# EAGLE schematic carcomputer_split3_bottom (EAGLE 9.3.2)
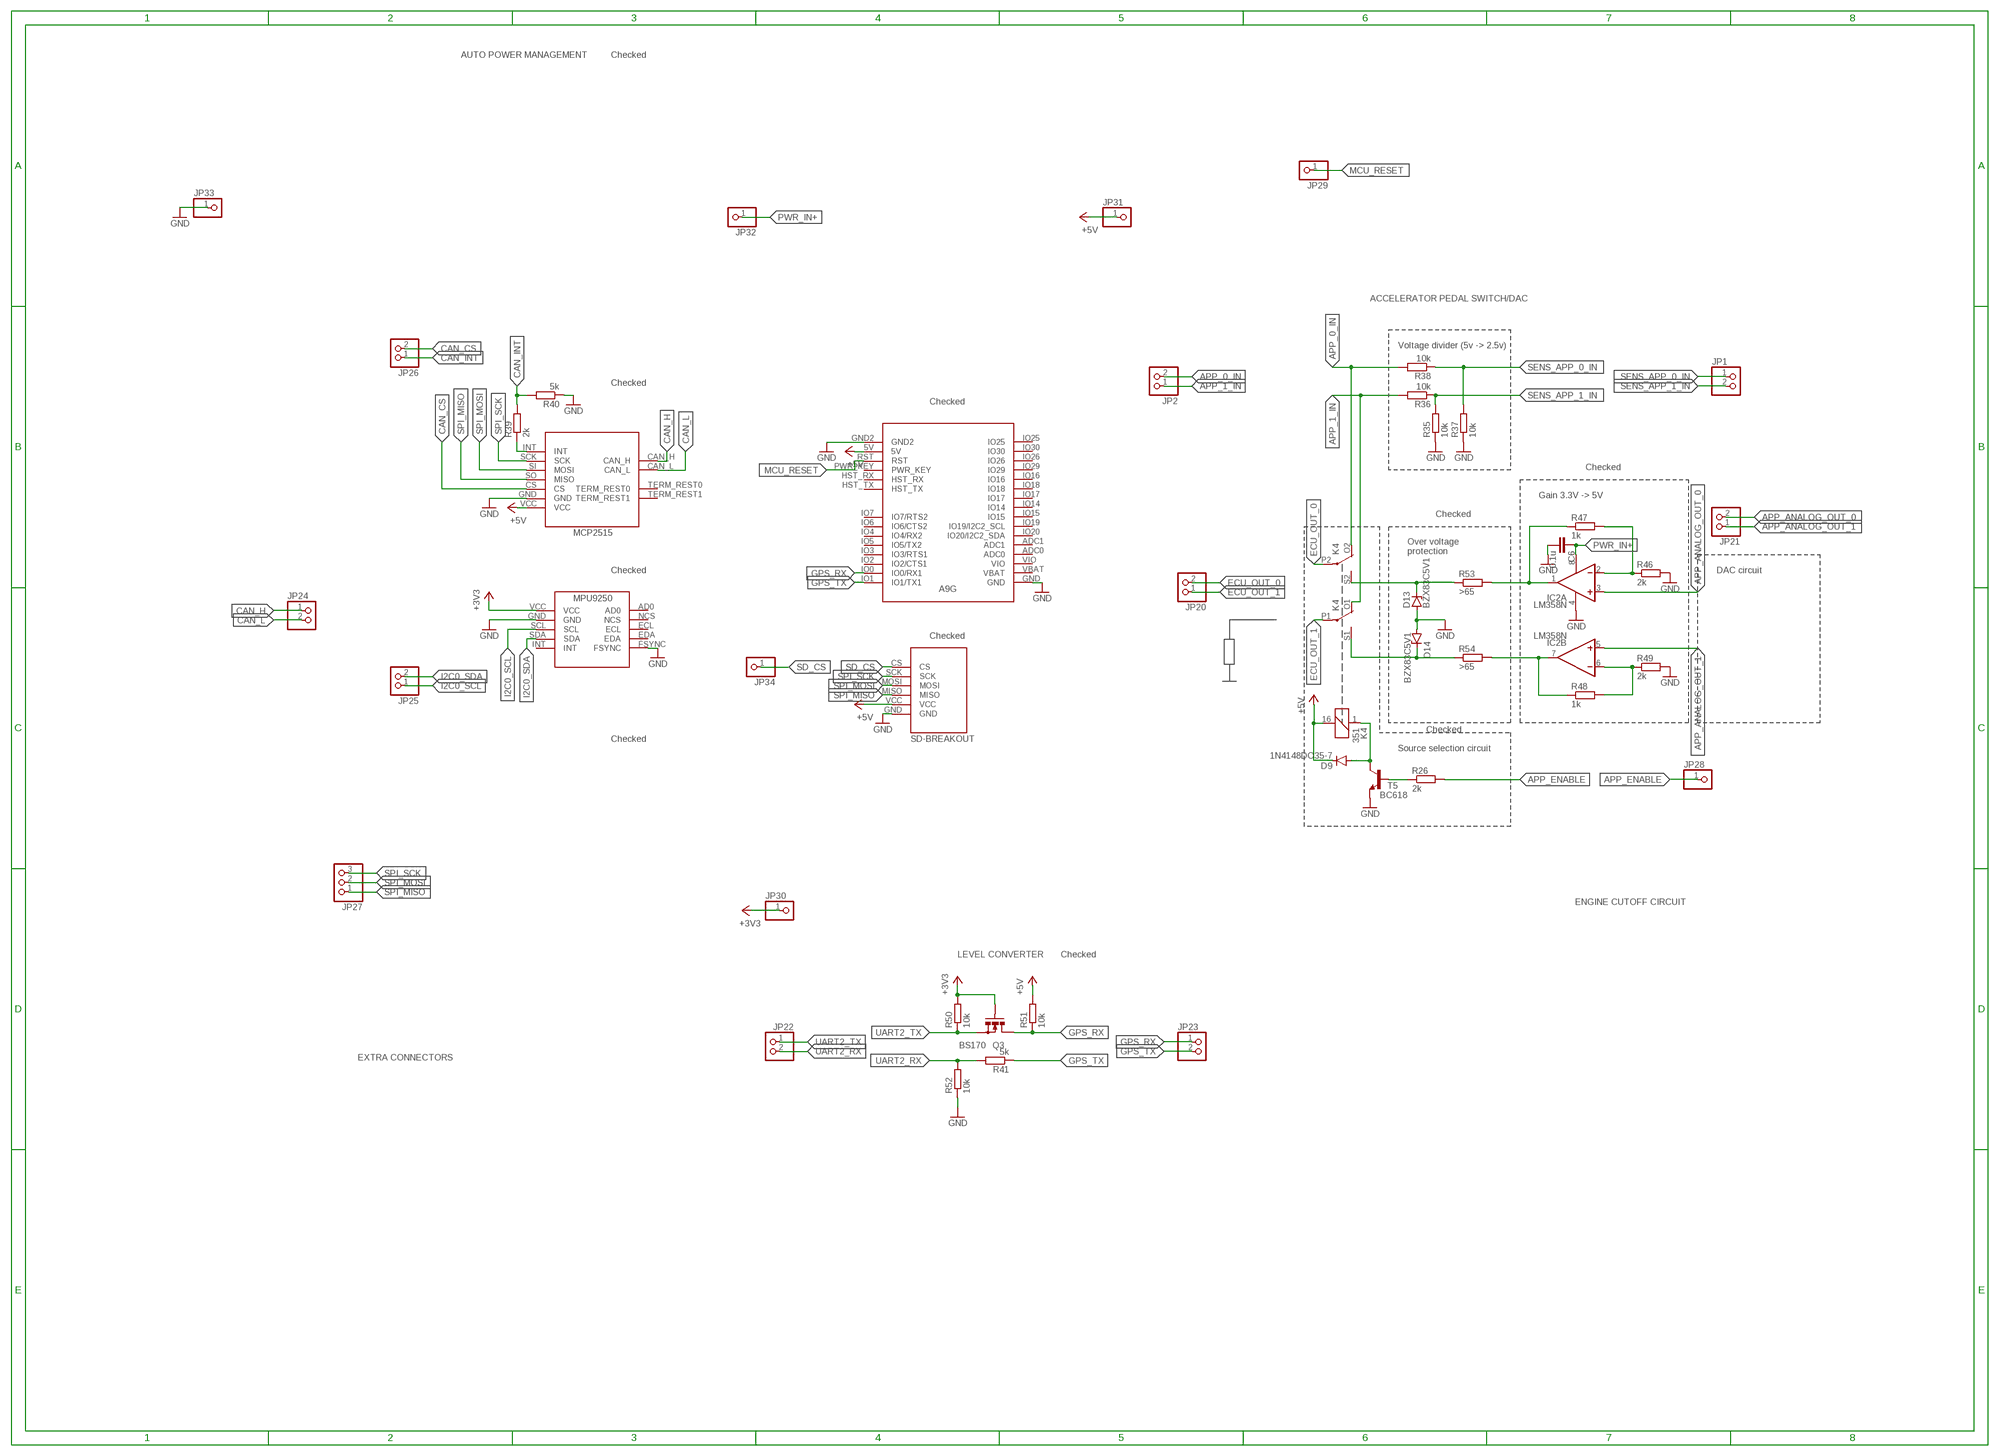
[diagram p0: schematic, sheet 1]

## Parts
C6  0.1u  C-EU025-050X050  [C025-050X050]
D9  1N4148DO35-7  [DO35-7]
D13  BZX83C5V1  BZX85  [DO41Z10]
D14  BZX83C5V1  BZX85  [DO41Z10]
IC2  LM358N  [DIL08]
JP1  PINHD-1X2  [1X02]
JP2  PINHD-1X2  [1X02]
JP20  PINHD-1X2  [1X02]
JP21  PINHD-1X2  [1X02]
JP22  PINHD-1X2  [1X02]
JP23  PINHD-1X2  [1X02]
JP24  PINHD-1X2  [1X02]
JP25  PINHD-1X2  [1X02]
JP26  PINHD-1X2  [1X02]
JP27  PINHD-1X3  [1X03]
JP28  PINHD-1X1  [1X01]
JP29  PINHD-1X1  [1X01]
JP30  PINHD-1X1  [1X01]
JP31  PINHD-1X1  [1X01]
JP32  PINHD-1X1  [1X01]
JP33  PINHD-1X1  [1X01]
JP34  PINHD-1X1  [1X01]
K4  351  [351]
Q3  BS170  [SOT54E]
R26  2k  R-EU_0207/7  [0207/7]
R35  10k  R-EU_0207/7  [0207/7]
R36  10k  R-EU_0207/7  [0207/7]
R37  10k  R-EU_0207/7  [0207/7]
R38  10k  R-EU_0207/7  [0207/7]
R39  2k  R-EU_0207/7  [0207/7]
R40  5k  R-EU_0207/7  [0207/7]
R41  5k  R-EU_0207/7  [0207/7]
R46  2k  R-EU_0207/7  [0207/7]
R47  1k  R-EU_0207/7  [0207/7]
R48  1k  R-EU_0207/7  [0207/7]
R49  2k  R-EU_0207/7  [0207/7]
R50  10k  R-EU_0207/7  [0207/7]
R51  10k  R-EU_0207/7  [0207/7]
R52  10k  R-EU_0207/7  [0207/7]
R53  >65  R-EU_0207/7  [0207/7]
R54  >65  R-EU_0207/7  [0207/7]
T5  BC618  [TO92-EBC]
U$8  MCP2515_DEVBOARDINVERTED  [MCP2515_DEVBOARD_INVERTED]
U$9  MPU9250_BREAKOUT  [MPU9250_BREAKOUT]
U$11  HKD-MICRO-SD-BREAKOUT  [HKD-MICRO-SD-BREAKOUT]
U$12  A9G  [A9G]

## Nets
+3V3: JP30.1 Q3.G R50.2 U$9.VCC
+5V: D9.C JP31.1 K4.16 R51.2 U$8.VCC U$11.VCC U$12.5V
APP_0_IN: JP2.2 K4.O2(3:O) R38.2
APP_1_IN: JP2.1 K4.O1(2:O) R36.2
APP_ANALOG_OUT_0: IC2.3(A:+IN) JP21.2
APP_ANALOG_OUT_1: IC2.5(B:+IN) JP21.1
APP_ENABLE: JP28.1 R26.2
CAN_CS: JP26.2 U$8.CS
CAN_H: JP24.1 U$8.CAN_H
CAN_INT: JP26.1 R39.2 R40.2
CAN_L: JP24.2 U$8.CAN_L
ECU_OUT_0: JP20.2 K4.P2(3:P)
ECU_OUT_1: JP20.1 K4.P1(2:P)
GND: C6.2 D13.A D14.A IC2.4(P:V-) JP33.1 R35.1 R37.1 R40.1 R46.2 R49.2 R52.1 T5.E U$8.GND U$9.FSYNC U$9.GND U$11.GND U$12.GND U$12.GND2
GPS_RX: JP23.1 Q3.D R51.1 U$12.IO0(IO0/RX1)
GPS_TX: JP23.2 R41.1 U$12.IO1(IO1/TX1)
I2C0_SCL: JP25.1 U$9.SCL
I2C0_SDA: JP25.2 U$9.SDA
MCU_RESET: JP29.1 U$12.RST
N$6: D9.A K4.1 T5.C
N$7: R26.1 T5.B
N$8: D14.C K4.S1(2:S) R54.1
N$9: IC2.1(A:OUT) R47.1 R53.2
N$24: R39.1 U$8.INT
N$33: IC2.2(A:-IN) R46.1 R47.2
N$34: IC2.6(B:-IN) R48.2 R49.1
N$35: D13.C K4.S2(3:S) R53.1
N$36: IC2.7(B:OUT) R48.1 R54.2
PWR_IN+: C6.1 IC2.8(P:V+) JP32.1
SD_CS: JP34.1 U$11.CS
SENS_APP_0_IN: JP1.1 R37.2 R38.1
SENS_APP_1_IN: JP1.2 R35.2 R36.1
SPI_MISO: JP27.1 U$8.SO(MISO) U$11.MISO
SPI_MOSI: JP27.2 U$8.SI(MOSI) U$11.MOSI
SPI_SCK: JP27.3 U$8.SCK U$11.SCK
UART2_RX: JP22.2 R41.2 R52.2
UART2_TX: JP22.1 Q3.S R50.1
Unconnected: U$8.TERM_REST0 U$8.TERM_REST1 U$9.AD0 U$9.ECL U$9.EDA U$9.INT U$9.NCS U$12.ADC0 U$12.ADC1 U$12.HST_RX U$12.HST_TX U$12.IO2(IO2/CTS1) U$12.IO3(IO3/RTS1) U$12.IO4(IO4/RX2) U$12.IO5(IO5/TX2) U$12.IO6(IO6/CTS2) U$12.IO7(IO7/RTS2) U$12.IO14 U$12.IO15 U$12.IO16 U$12.IO17 U$12.IO18 U$12.IO19(IO19/I2C2_SCL) U$12.IO20(IO20/I2C2_SDA) U$12.IO25 U$12.IO26 U$12.IO29 U$12.IO30 U$12.PWR_KEY U$12.VBAT U$12.VIO

## Notes on the sheet
- AUTO POWER MANAGEMENT | Checked
- ACCELERATOR PEDAL SWITCH/DAC
- Voltage divider (5v -> 2.5v)
- Checked
- Checked
- Checked
- Gain 3.3V -> 5V
- Checked
- Over voltage
  protection
- Checked | DAC circuit
- Checked
- Checked
- Checked
- Source selection circuit
- ENGINE CUTOFF CIRCUIT
- LEVEL CONVERTER | Checked
- EXTRA CONNECTORS

## Library data of the parts
C6 = rcl:C-EU: CAPACITOR, European symbol; SPICEPREFIX: C
D9 = diode:1N4148: DIODE high speed (Philips)
D13 D14 = diode:BZX85: Z DIODE
IC2 = linear:LM358: OP AMP also LM158; LM258; LM2904 Source: http://cache.national.com/ds/LM/LM158.pdf
JP1 JP2 JP20-JP26 = pinhead:PINHD-1X2: PIN HEADER
JP27 = pinhead:PINHD-1X3: PIN HEADER
JP28-JP34 = pinhead:PINHD-1X1: PIN HEADER
K4 = relay:351: RELAY 2 x switch, Omron; OC_FARNELL: unknown; OC_NEWARK: unknown
Q3 = transistor-small-signal:BS170: N-CHANNEL MOS FET
R26 R35-R41 R46-R54 = rcl:R-EU_: RESISTOR, European symbol; SPICEPREFIX: R
T5 = transistor-npn:BC618*: NPN Transistor
U$8 = MCP2515:MCP2515_DEVBOARD
U$9 = MPU9250:MPU9250_BREAKOUT
U$11 = sd-mmc:HKD-MICRO-SD-BREAKOUT
U$12 = A9:A9G